# Altium schematic sheet four_neopixels.SchDoc
size A4; SheetNumber: 2; SheetTotal: 2
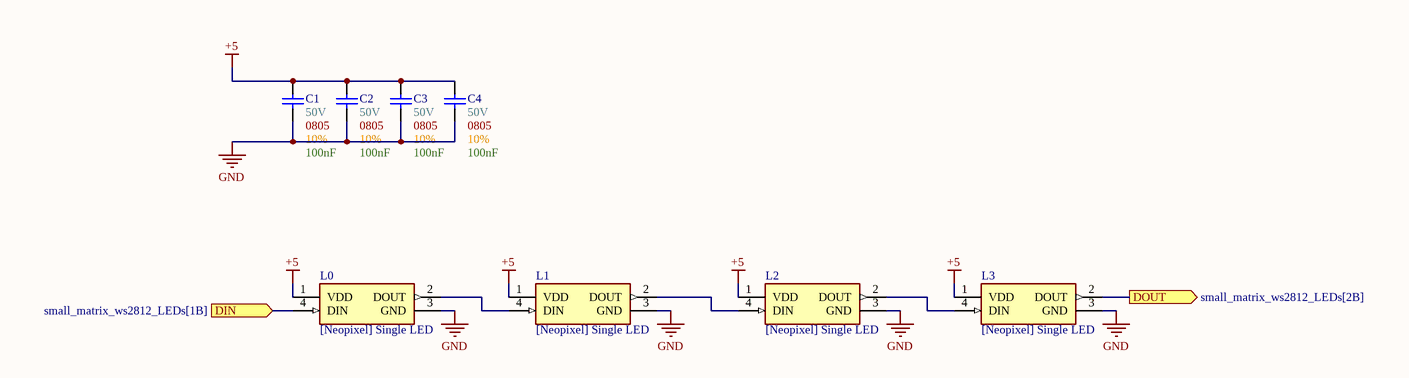
[diagram p0: four_neopixels.SchDoc]

## Parts
C1  Max Voltage: 50V  Size Package: 0805  Tolerance: 10%  Capacitance: 100nF  [[Cap] SMD 0805]  (hidden comment: [Cap] 0805 0.1uF 10% 50V)
C2  Max Voltage: 50V  Size Package: 0805  Tolerance: 10%  Capacitance: 100nF  [[Cap] SMD 0805]  (hidden comment: [Cap] 0805 0.1uF 10% 50V)
C3  Max Voltage: 50V  Size Package: 0805  Tolerance: 10%  Capacitance: 100nF  [[Cap] SMD 0805]  (hidden comment: [Cap] 0805 0.1uF 10% 50V)
C4  Max Voltage: 50V  Size Package: 0805  Tolerance: 10%  Capacitance: 100nF  [[Cap] SMD 0805]  (hidden comment: [Cap] 0805 0.1uF 10% 50V)
L0  [Neopixel] Single LED  [[Neopixel] Single LED]
L1  [Neopixel] Single LED  [[Neopixel] Single LED]
L2  [Neopixel] Single LED  [[Neopixel] Single LED]
L3  [Neopixel] Single LED  [[Neopixel] Single LED]

## Ports
DIN (in, see small_matrix_ws2812_LEDs[1B]), DOUT (out, see small_matrix_ws2812_LEDs[2B])

## Nets
+5: C1.2 C2.2 C3.2 C4.2 L0.1(VDD) L1.1(VDD) L2.1(VDD) L3.1(VDD)
GND: C1.1 C2.1 C3.1 C4.1 L0.3(GND) L1.3(GND) L2.3(GND) L3.3(GND)
DIN: L0.4(DIN) ; port DIN
DOUT: L3.2(DOUT) ; port DOUT
NetL0_2: L0.2(DOUT) L1.4(DIN)
NetL1_2: L1.2(DOUT) L2.4(DIN)
NetL2_2: L2.2(DOUT) L3.4(DIN)

## Notes on the sheet
- Project/Vehicle:
- Author(s):
- -
- Revisor(s):
- Git Repo:
- Git Hash:
- Date:
- Revision:
- Size:
- A4
- File:
- Sheet
- of

## Library data of the parts
C1-C4 = [Cap] 0805 0.1uF 10% 50V: CL21B104KBCNNNC; Supplier 1: DigiKey; Supplier Part Number 1: 1276-1003-6-ND
L0-L3 = [Neopixel] Single LED: WS2812B; Supplier 1: DigiKey; Supplier Part Number 1: 1568-16347CT-ND